# EAGLE design Transistor_as_Switch (EAGLE 9.6.2)
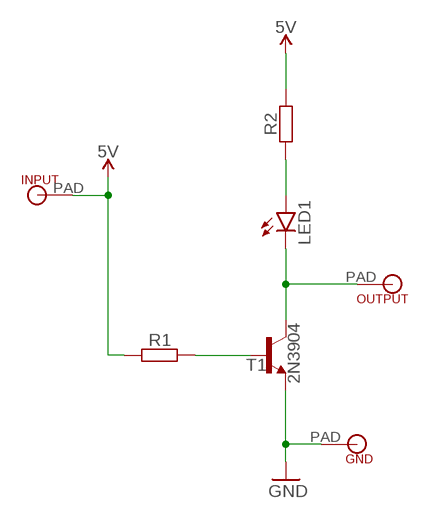
[diagram p0: schematic, sheet 1]

## Parts
GND  MICROBIT_PAD  [MICROBIT_PAD]
INPUT  MICROBIT_PAD  [MICROBIT_PAD]
LED1  LEDCHIP-LED0805  [CHIP-LED0805]
OUTPUT  MICROBIT_PAD  [MICROBIT_PAD]
R1  RESISTOR-10  [R0207/10]
R2  RESISTOR-10  [R0207/10]
T1  2N3904  [TO92]

## Nets
5V: INPUT.PAD R1.1 R2.2
GND: GND.PAD T1.3(E)
N$1: LED1.A R2.1
N$2: LED1.C OUTPUT.PAD T1.1(C)
N$3: R1.2 T1.2(B)

## Library data of the parts
GND INPUT OUTPUT = microbit:MICROBIT_PAD
LED1 = led:LED: LED OSRAM: - CHIPLED LG R971, LG N971, LY N971, LG Q971, LY Q971, LO R971, LY R971 LH N974, LH R974 LS Q976, LO Q976, LY Q976 LO Q996 - Hyper CHIPLED LW Q18S LB Q993, LB Q99A, LB R99A - SideLED LS A670, LO A670, LY A670, LG A670, LP A670 LB A673, LV A673, LT A673, LW A673 LH A674 LY A675 LS A676, LA A676, LO A676, LY A676, LW A676 LS A679, LY A679, LG A679 - Hyper Micro SIDELED® LS Y876, LA Y876, LO Y876, LY Y876 LT Y87S - SmartLED LW L88C, LW L88S LB L89C, LB L89S, LG L890 LS L89K, LO L89K, LY L89K LS L896, LA L896, LO L896, LY L896 - TOPLED LS T670, LO T670, LY T670, LG T670, LP T670 LSG T670, LSP T670, LSY T670, LOP T670, LYG T670 LG T671, LOG T671, LSG T671 LB T673, LV T673, LT T673, LW T673 LH T674 LS T676, LA T676, LO T676, LY T676, LB T676, LH T676, LSB T676, LW T676 LB T67C, LV T67C, LT T67C, LS T67K, LO T67K, LY T67K, LW E67C LS E67B, LA E67B, LO E67B, LY E67B, LB E67C, LV E67C, LT E67C LW T67C LS T679, LY T679, LG T679 LS T770, LO T770, LY T770, LG T770, LP T770 LB T773, LV T773, LT T773, LW T773 LH T774 LS E675, LA E675, LY E675, LS T675 LS T776, LA T776, LO T776, LY T776, LB T776 LHGB T686 LT T68C, LB T68C - Hyper Mini TOPLED® LB M676 - Mini TOPLED Santana® LG M470 LS M47K, LO M47K, LY M47K Source: http://www.osram.convergy.de LUXEON: - LUMILED® LXK2-PW12-R00, LXK2-PW12-S00, LXK2-PW14-U00, LXK2-PW14-V00 LXK2-PM12-R00, LXK2-PM12-S00, LXK2-PM14-U00 LXK2-PE12-Q00, LXK2-PE12-R00, LXK2-PE12-S00, LXK2-PE14-T00, LXK2-PE14-U00 LXK2-PB12-K00, LXK2-PB12-L00, LXK2-PB12-M00, LXK2-PB14-N00, LXK2-PB14-P00, LXK2-PB14-Q00 LXK2-PR12-L00, LXK2-PR12-M00, LXK2-PR14-Q00, LXK2-PR14-R00 LXK2-PD12-Q00, LXK2-PD12-R00, LXK2-PD12-S00 LXK2-PH12-R00, LXK2-PH12-S00 LXK2-PL12-P00, LXK2-PL12-Q00, LXK2-PL12-R00 Source: www.luxeon.com KINGBRIGHT: KA-3528ASYC Source: www.kingbright.com
R1 R2 = we-rcl:RESISTOR: Resistor all kinds in 0402 and 0603
T1 = transistor:2N3904: NPN TRANSISTOR

## Board
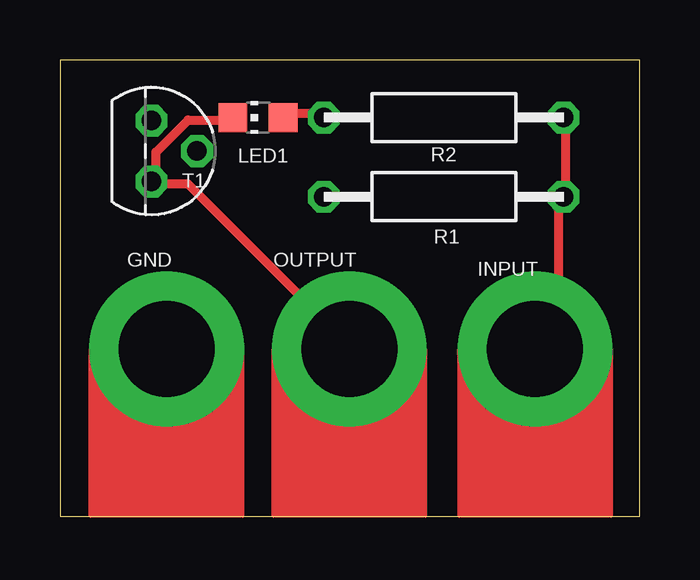
[diagram p1: board, top side]
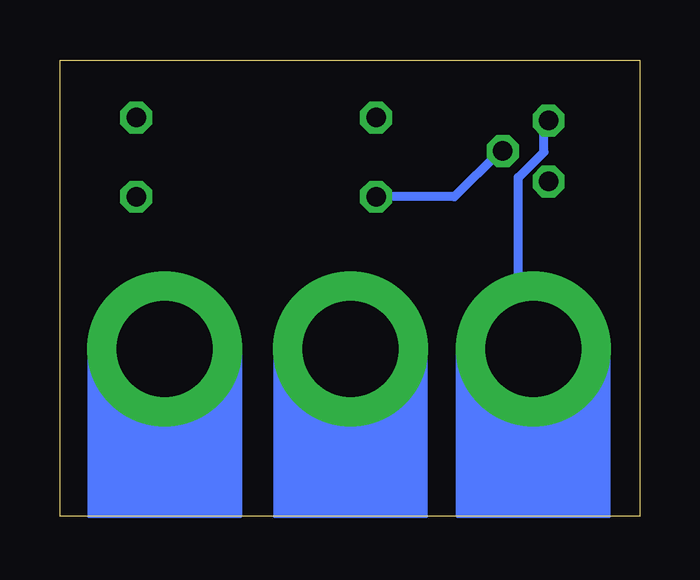
[diagram p2: board, bottom side, seen from below]

Size 24.18 x 19.04 mm. Coordinates in mm from the lower left corner, seen from the top.
Outline: 0,0 24.18,0 24.18,19.04 0,19.04 0,0
Copper layers (1*16): Top 0.035mm / dielectric 1.5mm / Bottom 0.035mm
Design rules "default *": minimum track width 15mil, minimum drill 0.35mm, track to track 6mil, track to pad 6mil, pad to pad 6mil, via to via 6mil, smd to smd 6mil, copper to edge 40mil, drill to drill 6mil, minimum pad ring 10mil, minimum via ring 8mil, stop-mask expansion 4mil, vias tented up to drill 0mil, thermal gap 10mil

### Footprints (pad centres in the part's own frame; a part is rotated, then mirrored left to right if it is on the bottom)
MICROBIT_PAD = drill 4 pad 6.452: PAD 0,0
CHIP-LED0805 = smd 1.2 x 1.2: A 0,-1.05; C 0,1.05
R0207/10 = drill 0.813 octagon: 1 -5,0; 2 5,0
TO92 = drill 0.813 octagon: 1 1.27,0; 2 0,1.905; 3 -1.27,0

### Placement (x,y rotation side)
GND  4.45,6.99 0 top
INPUT  19.81,6.99 0 top
LED1  8.26,16.64 90 top
OUTPUT  12.06,6.99 0 top
R1  16,13.34 180 top
R2  16,16.64 0 top
T1  3.81,15.24 270 top

### Tracks (layer width: path | path; a pad name or v marks a point on that pad's centre or on a via)
5V
  Top 0.381: R2.2 21.07,16.54 21.07,13.34 R1.1 20.8,13.34 20.8,8 20,7.2 INPUT.PAD
GND
  Bottom 0.381: T1.3 4,16.27 4,15.2 5.07,14.13 5.07,7.73 4.53,7.2 GND.PAD
N$1
  Top 0.381: LED1.A 9.34,16.8 10.94,16.8 R2.1
N$2
  Top 0.381: LED1.C 7.2,16.54 5.33,16.54 4,15.2 4,14.13 T1.1 4,13.87 5.33,13.87 12,7.2 OUTPUT.PAD
N$3
  Bottom 0.381: R1.2 7.73,13.34 5.87,15.2 T1.2